# Altium project Subboard.PrjPCB (part 2 of 2)

## Sheet uc1B.SchDoc: Microcontroller 1 (Part B)
size A4; Author: Marcel Hellwig; Organization: Hamburg Bit-Bots; Address1: Vogt-Kölln-Str. 30; Address2: 22527 Hamburg; Address3: Germany; Address4: www.bit-bots.de; DocumentNumber: 4; Revision: A; SheetNumber: 4; SheetTotal: 16; EMail: info@bit-bots.de
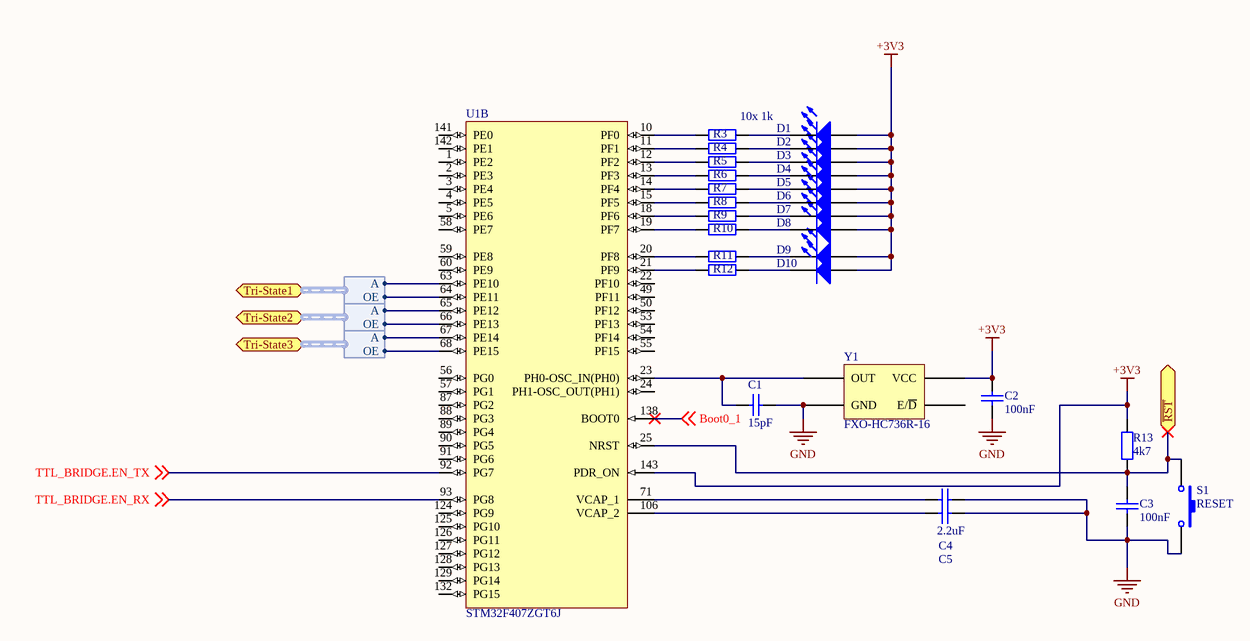
[diagram p9: uc1B.SchDoc]

### Parts
C1  15pF  [C2012]
C2  100nF  [C2012]
C3  100nF  [C2012]
C4  2.2uF  [C2012]  (value not drawn)
C5  2.2uF  [C2012]
D1  Green  [MLCC2]  (value not drawn)
D2  Green  [MLCC2]  (value not drawn)
D3  Green  [MLCC2]  (value not drawn)
D4  Green  [MLCC2]  (value not drawn)
D5  Green  [MLCC2]  (value not drawn)
D6  Green  [MLCC2]  (value not drawn)
D7  Green  [MLCC2]  (value not drawn)
D8  Green  [MLCC2]  (value not drawn)
D9  Green  [MLCC2]  (value not drawn)
D10  Green  [MLCC2]  (value not drawn)
R3  1k  [R2012]  (value not drawn)
R4  1k  [R2012]  (value not drawn)
R5  1k  [R2012]  (value not drawn)
R6  1k  [R2012]  (value not drawn)
R7  1k  [R2012]  (value not drawn)
R8  1k  [R2012]  (value not drawn)
R9  1k  [R2012]  (value not drawn)
R10  1k  [R2012]  (value not drawn)
R11  1k  [R2012]  (value not drawn)
R12  1k  [R2012]  (value not drawn)
R13  4k7  [R2012]
S1  RESET  [SWITCH]
U1  STM32F407ZGT6J  [STM-LQFP144_M]  (part B of 3)
Y1  FXO-HC736R-16  [FXO-HC73]

### Ports
Tri-State1 (harness Tri-State), Tri-State2 (harness Tri-State), Tri-State3 (harness Tri-State), ~{RST}

### Harnesses
Tri-State: A, OE

### Nets
+3V3: C2.1 D1.1(A) D2.1(A) D3.1(A) D4.1(A) D5.1(A) D6.1(A) D7.1(A) D8.1(A) D9.1(A) D10.1(A) R13.1 U1.143(PDR_ON) Y1.4(VCC)
GND: C1.1 C2.2 C3.1 C4.2 C5.2 S1.2 Y1.2(GND)
~{RST}: C3.2 R13.2 S1.1 U1.25(NRST) ; port ~{RST}
Boot0_1: U1.138(BOOT0) ; off-sheet Boot0_1
TTL_BRIDGE.EN_RX: U1.93(PG8) ; off-sheet TTL_BRIDGE.EN_RX
TTL_BRIDGE.EN_TX: U1.92(PG7) ; off-sheet TTL_BRIDGE.EN_TX
NetC1_2: C1.2 U1.23(PH0-OSC_IN(PH0)) Y1.3(OUT)
NetC4_1: C4.1 U1.71(VCAP_1)
NetC5_1: C5.1 U1.106(VCAP_2)
NetD1_2: D1.2(K) R3.2
NetD2_2: D2.2(K) R4.2
NetD3_2: D3.2(K) R5.2
NetD4_2: D4.2(K) R6.2
NetD5_2: D5.2(K) R7.2
NetD6_2: D6.2(K) R8.2
NetD7_2: D7.2(K) R9.2
NetD8_2: D8.2(K) R10.2
NetD9_2: D9.2(K) R11.2
NetD10_2: D10.2(K) R12.2
NetR3_1: R3.1 U1.10(PF0)
NetR4_1: R4.1 U1.11(PF1)
NetR5_1: R5.1 U1.12(PF2)
NetR6_1: R6.1 U1.13(PF3)
NetR7_1: R7.1 U1.14(PF4)
NetR8_1: R8.1 U1.15(PF5)
NetR9_1: R9.1 U1.18(PF6)
NetR10_1: R10.1 U1.19(PF7)
NetR11_1: R11.1 U1.20(PF8)
NetR12_1: R12.1 U1.21(PF9)
NetU1_63: U1.63(PE10) ; port Tri-State1.A
NetU1_64: U1.64(PE11) ; port Tri-State1.OE
NetU1_65: U1.65(PE12) ; port Tri-State2.A
NetU1_66: U1.66(PE13) ; port Tri-State2.OE
NetU1_67: U1.67(PE14) ; port Tri-State3.A
NetU1_68: U1.68(PE15) ; port Tri-State3.OE

Not connected (* = marked no-connect by the designer): U1 1(PE2) 2(PE3) 3(PE4) 4(PE5) 5(PE6) 22(PF10) 24(PH1-OSC_OUT(PH1)) 49(PF11) 50(PF12) 53(PF13) 54(PF14) 55(PF15) 56(PG0) 57(PG1) 58(PE7) 59(PE8) 60(PE9) 87(PG2) 88(PG3) 89(PG4) 90(PG5) 91(PG6) 124(PG9) 125(PG10) 126(PG11) 127(PG12) 128(PG13) 129(PG14) 132(PG15) 141(PE0) 142(PE1); Y1 1(E/~{D})

### Notes on the sheet
- (near R3) 10x 1k
- Project:
- Author:
- Title:
- Rev:
- Date:
- Time:
- Sheet
- of

### Library data of the parts
C1 = Cap: Capacitor; Manufacturer: MULTICOMP; Manufacturer Part Number: MC0805N150J500CT; Produktpalette: Baureihe MC; Kapazität: 15; Kapazitätstoleranz: ±5%; Dielektrikum: C0G / NP0; Nennspannung: 50; Keramikkondensatorgehäuse: 0805 [Metrisch 2012]; Betriebstemperatur, min.: -55; Betriebstemperatur, max.: 125; Verpackung: Gurtabschnitt; SVHC: No SVHC (17-Dec-2014); Betriebstemperatur: -55°C bis +125; Kondensatoranschlüsse: SMD<!--FANDB--><div class="features-and-benefits-container"></div>; Published: 8-Jun-2000; LatestRevisionDate: 17-Jul-2002; LatestRevisionNote: Re-released for DXP Platform.; PackageReference: RAD-0.3; Publisher: Altium Limited; PackageDescription: Radial Cap, Thru-Hole; 2 Leads; 0.3 in Pin Spacing; Value: 15pF; Supplier 1: Farnell; Supplier Part Number 1: 1759193; RoHS: YES; Stock 1: 38433; Pricing 1: 10=0,021, 100=0,017, 500=0,014, 1000=0,012, 2000=0,009 (EUR); MSL: -; Bauform: 0805 [Metrisch 2012]; Kapazitätstoleranz ±: ±5%; ComponentLink1URL: http://www.farnell.com/datasheets/1870456.pdf; ComponentLink1Description: http://www.farnell.com/datasheets/1870456.pdf
C2 = Cap: Capacitor; Published: 8-Jun-2000; LatestRevisionDate: 17-Jul-2002; LatestRevisionNote: Re-released for DXP Platform.; PackageReference: RAD-0.3; Publisher: Altium Limited; PackageDescription: Radial Cap, Thru-Hole; 2 Leads; 0.3 in Pin Spacing; Value: 100nF; Supplier 1: Farnell; Supplier Part Number 1: 1759265
C3 = Cap: Capacitor; Manufacturer: MULTICOMP; Manufacturer Part Number: MC0805B104K500CT; Produktpalette: Baureihe MC; Kapazität: 0.1; Kapazitätstoleranz: ±10%; Dielektrikum: X7; Nennspannung: 50; Keramikkondensatorgehäuse: 0805 [Metrisch 2012]; Betriebstemperatur, min.: -55; Betriebstemperatur, max.: 125; Verpackung: Gurtabschnitt; SVHC: No SVHC (17-Dec-2014); Betriebstemperatur: -55°C bis +125; Kondensatoranschlüsse: SMD<!--FANDB--><div class="features-and-benefits-container"></div>; Published: 8-Jun-2000; LatestRevisionDate: 17-Jul-2002; LatestRevisionNote: Re-released for DXP Platform.; PackageReference: RAD-0.3; Publisher: Altium Limited; PackageDescription: Radial Cap, Thru-Hole; 2 Leads; 0.3 in Pin Spacing; Value: 100nF; Supplier 1: Farnell; Supplier Part Number 1: 1759265; RoHS: YES; Stock 1: 692587; Pricing 1: 10=0,013, 100=0,011, 500=0,009, 1000=0,008, 2000=0,006 (EUR); MSL: -; Bauform: 0805 [Metrisch 2012]; Kapazitätstoleranz ±: ±10%; ComponentLink1URL: http://www.farnell.com/datasheets/1870456.pdf; ComponentLink1Description: http://www.farnell.com/datasheets/1870456.pdf
C4 C5 = Cap: Capacitor; Manufacturer: MULTICOMP; Manufacturer Part Number: MC0805B225K250CT; Produktpalette: Baureihe MC; Kapazität: 2.2; Kapazitätstoleranz: ±10%; Dielektrikum: X7; Nennspannung: 25; Keramikkondensatorgehäuse: 0805 [Metrisch 2012]; Betriebstemperatur, min.: -55; Betriebstemperatur, max.: 125; Verpackung: Gurtabschnitt; Kondensatoranschlüsse: SMD<!--FANDB--><div class="features-and-benefits-container"></div>; Published: 8-Jun-2000; LatestRevisionDate: 17-Jul-2002; LatestRevisionNote: Re-released for DXP Platform.; PackageReference: RAD-0.3; Publisher: Altium Limited; PackageDescription: Radial Cap, Thru-Hole; 2 Leads; 0.3 in Pin Spacing; Value: 2.2uF; Supplier 1: Farnell; Supplier Part Number 1: 2320829; RoHS: YES; Stock 1: 13870; Pricing 1: 10=0,101, 100=0,084, 500=0,071, 1000=0,058, 1500=0,046 (EUR); MSL: MSL 1 - unbegrenzt; Bauform: 0805 [Metrisch 2012]; Kapazitätstoleranz ±: ±10%; ComponentLink1URL: http://www.farnell.com/datasheets/1870456.pdf; ComponentLink1Description: http://www.farnell.com/datasheets/1870456.pdf
D1-D10 = LED0: Typical INFRARED GaAs LED; Manufacturer: VISHAY; Manufacturer Part Number: VLMC3100-GS08; Leuchtengröße: 2.4; LED-Farbe: Grün; Lichtstärke: 1.6; Abstrahlwinkel: 120°; Durchlassstrom If: 2; Durchlassspannung: 1.9; LED-Montage: Oberflächenmontage; Linsenform: Rund; Wellenlänge, typ.: 575; Verpackung: Gurtabschnitt; SVHC: No SVHC (16-Jun-2014); Betriebstemperatur: -40°C bis +100; Betriebstemperatur, max.: 100; Betriebstemperatur, min.: -40; LED-Typ: Standard; LED/Lampen Größe: PLCC-2; Montage: SMD; Sperrspannung: 6; Spitzenwellenlänge: 565; Winkel halber Empfindlichkeit ±: 60; Published: 8-Jun-2000; LatestRevisionDate: 08-Jul-2005; LatestRevisionNote: Mech Layer 1 removed.; PackageReference: LED-0; Publisher: Altium Limited; PackageDescription: LED; 2 Leads; Supplier 1: Farnell; Supplier Part Number 1: 1659076; RoHS: YES; Stock 1: 12975; Pricing 1: 5=0,105, 25=0,0998, 100=0,0952, 250=0,0917, 500=0,0865, 2000=0,0771, 4000=0,0717, 20000=0,0689 (EUR); MSL: MSL 2A - 4 Wochen; Anzahl der Pins: 2; Dominante Wellenlänge: 575; Durchlassspannung Vf max.: 2.4; Durchlassstrom If, max.: 2; Lichtstärke, typ.: 1.6; ComponentLink1URL: http://www.farnell.com/datasheets/1698102.pdf; ComponentLink1Description: http://www.farnell.com/datasheets/1698102.pdf
R3-R12 = Res2: as R47 on sheet connector; Published: 8-Jun-2000; LatestRevisionDate: 17-Jul-2002; LatestRevisionNote: Re-released for DXP Platform.; PackageReference: AXIAL-0.4; Publisher: Altium Limited; PackageDescription: Axial Device, Thru-Hole; 2 Leads; 0.4 in Pin Spacing; Value: 1k; Supplier 1: Farnell; Supplier Part Number 1: 9332391; RoHS: Y-EX; Stock 1: 4370; Pricing 1: 50=0,038, 250=0,031, 1000=0,022, 5000=0,014, 15000=0,009 (EUR); ComponentLink1URL: http://www.farnell.com/datasheets/1729047.pdf; ComponentLink1Description: http://www.farnell.com/datasheets/1729047.pdf; ComponentLink2URL: http://www.farnell.com/cad/1561156.zip; ComponentLink2Description: http://www.farnell.com/cad/1561156.zip
R13 = Res2: Resistor; Manufacturer: MULTICOMP; Manufacturer Part Number: MC01W080514K7; Produktpalette: Baureihe MC; Widerstand: 4.7; Nennleistung: 100; Widerstandstoleranz: ±1%; Bauform: 0805 [Metrisch 2012]; Widerstandselement: Dickschicht; Temperaturkoeffizient: ±100; Nennspannung: 150; Verpackung: Gurtabschnitt; SVHC: No SVHC (17-Dec-2014); Anzahl der Pins: 2; Außenbreite: 1.25; Außentiefe: 0.55; Bandbreite: 8; Baureihe: MC; Betriebstemperatur: -55°C bis +155; Betriebstemperatur, max.: 155; Betriebstemperatur, min.: -55; Menge pro Rolle: 5000; Toleranz (+): 1%; Widerstandsmontage: Oberflächenmontage<!--FANDB--><div class="features-and-benefits-container"></div>; Published: 8-Jun-2000; LatestRevisionDate: 17-Jul-2002; LatestRevisionNote: Re-released for DXP Platform.; PackageReference: AXIAL-0.4; Publisher: Altium Limited; PackageDescription: Axial Device, Thru-Hole; 2 Leads; 0.4 in Pin Spacing; Value: 4k7; Supplier 1: Farnell; Supplier Part Number 1: 9333266; RoHS: Y-EX; Stock 1: 190984; Pricing 1: 50=0,038, 250=0,031, 1000=0,022, 5000=0,014, 15000=0,009 (EUR); MSL: -; Außenlänge/-höhe: 2; Nennspannung, V DC: 150; Temperaturkoeffizient, +: 100; Temperaturkoeffizient, -: 100; Toleranz (-): 1%; ComponentLink1URL: http://www.farnell.com/datasheets/1729047.pdf; ComponentLink1Description: http://www.farnell.com/datasheets/1729047.pdf; ComponentLink2URL: http://www.farnell.com/cad/1561170.zip; ComponentLink2Description: http://www.farnell.com/cad/1561170.zip
S1 = SW-PB: Switch; Published: 24-Mar-1999; LatestRevisionDate: 17-Jul-2002; LatestRevisionNote: Re-released for DXP Platform.; PackageReference: SPST-2; Publisher: Altium Limited; PackageDescription: Switch; 2 Leads; Supplier 1: Farnell; Supplier Part Number 1: 2396053
U1 = CMP-0243-00063-2: ARM Cortex-M4 32-bit MCU+FPU, 210 DMIPS, 1024 kB Flash, 192 kB Internal RAM, 114 I/Os, 144-pin LQFP, -40 to 85 degC, Tray; Manufacturer: STMicroelectronics; I/Os (High Current): 114; D/A Converter: 2x12-bit; Internal RAM Size (kB): 192; Operating Frequency(F) (Processor speed) (MHz): 168; Supply Voltage(Vcc) max (V): 3.6; Supply Voltage(Vcc) min (V): 1.8; FLASH Size (Prog) (kB): 1024; ComponentLink3Description: Package Specification; PackageVersion: Rev. 4, 06/2013; PartNumber: STM32F407ZGT6J; ComponentLink3URL: http://www.st.com/st-web-ui/static/active/en/resource/technical/document/datasheet/DM00037051.pdf; PackageReference: LQFP144; ComponentLink2URL: http://www.st.com/st-web-ui/static/active/en/resource/technical/document/datasheet/DM00037051.pdf; ComponentLink2Description: Datasheet; ComponentLink1Description: Manufacturer URL; Mounting Technology: Surface Mount; Core: ARM Cortex-M4; PackageDescription: 144-Pin Low Profile Quad Flat Package, 20 x 20 mm Body, 0.5 mm Pitch; Packing: Tray; ComponentLink1URL: http://www.st.com/web/en/home.html; DatasheetVersion: Rev. 4; PartId: 1; Supplier 1: Farnell; Supplier Part Number 1: 2333299
Y1 = Oszillator: Oscillator with Enable Input; Manufacturer: FOX ELECTRONICS; Produktpalette: Baureihe FXO-HC53; Nennfrequenz: 16; Frequenzstabilität + / -: 25; Versorgungsspannung, nom.: 3.3; Oszillatorgehäuse: SMD, 7mm x 5; Kompatibler Oszillatorausgang: HCMOS; Betriebstemperatur, min.: -40; Betriebstemperatur, max.: 85; SVHC: No SVHC (17-Dec-2014; Supplier 1: Farnell; Supplier Part Number 1: 1640997; Manufacturer Part Number: FXO-HC736R-16; RoHS: YES; Stock 1: 98; Pricing 1: 1=1,74, 25=1,71, 50=1,68, 100=1,65, 200=1,62, 700=1,59, 2000=1,56, 4000=1,52 (EUR); ComponentLink1URL: http://www.farnell.com/datasheets/75444.pdf; ComponentLink1Description: http://www.farnell.com/datasheets/75444.pdf

## Sheet uc1C.SchDoc: Microcontroller 1 (Part C)
size A4; Author: Marcel Hellwig; Organization: Hamburg Bit-Bots; Address1: Vogt-Kölln-Str. 30; Address2: 22527 Hamburg; Address3: Germany; Address4: www.bit-bots.de; DocumentNumber: 5; Revision: A; SheetNumber: 5; SheetTotal: 16; EMail: info@bit-bots.de
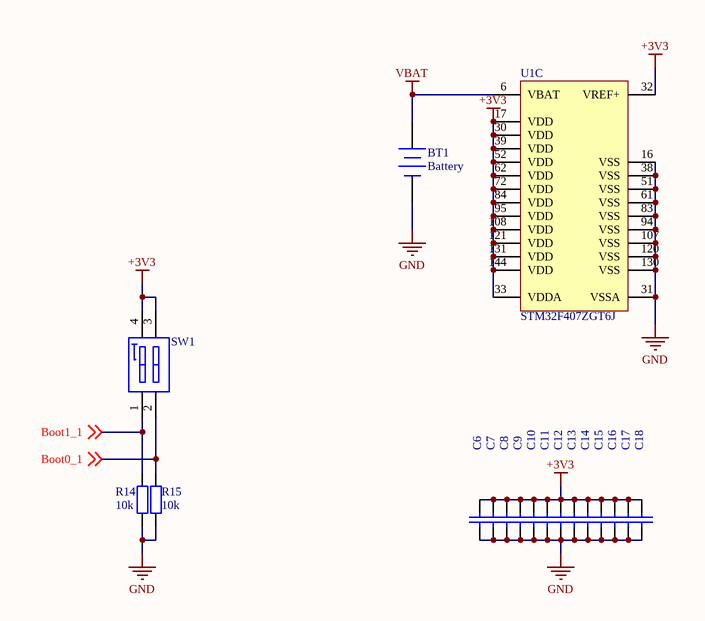
[diagram p10: uc1C.SchDoc]

### Parts
BT1  Battery  [2032 SMD Holder]
C6  100nF  [C2012]  (value not drawn)
C7  100nF  [C2012]  (value not drawn)
C8  100nF  [C2012]  (value not drawn)
C9  100nF  [C2012]  (value not drawn)
C10  100nF  [C2012]  (value not drawn)
C11  100nF  [C2012]  (value not drawn)
C12  100nF  [C2012]  (value not drawn)
C13  100nF  [C2012]  (value not drawn)
C14  100nF  [C2012]  (value not drawn)
C15  100nF  [C2012]  (value not drawn)
C16  100nF  [C2012]  (value not drawn)
C17  100nF  [C2012]  (value not drawn)
C18  100nF  [C2012]  (value not drawn)
R14  10k  [R2012]
R15  10k  [R2012]
SW1  418121270802  [418121270802]  (value not drawn)
U1  STM32F407ZGT6J  [STM-LQFP144_M]  (part C of 3)

### Nets
+3V3: C6.2 C7.2 C8.2 C9.2 C10.2 C11.2 C12.2 C13.2 C14.2 C15.2 C16.2 C17.2 C18.2 SW1.3 SW1.4 U1.17(VDD) U1.30(VDD) U1.32(VREF+) U1.33(VDDA) U1.39(VDD) U1.52(VDD) U1.62(VDD) U1.72(VDD) U1.84(VDD) U1.95(VDD) U1.108(VDD) U1.121(VDD) U1.131(VDD) U1.144(VDD)
GND: BT1.2(-) C6.1 C7.1 C8.1 C9.1 C10.1 C11.1 C12.1 C13.1 C14.1 C15.1 C16.1 C17.1 C18.1 R14.2 R15.1 U1.16(VSS) U1.31(VSSA) U1.38(VSS) U1.51(VSS) U1.61(VSS) U1.83(VSS) U1.94(VSS) U1.107(VSS) U1.120(VSS) U1.130(VSS)
VBAT: BT1.1(+) U1.6(VBAT)
Boot0_1: R15.2 SW1.2 ; off-sheet Boot0_1
Boot1_1: R14.1 SW1.1 ; off-sheet Boot1_1

### Notes on the sheet
- Project:
- Author:
- Title:
- Rev:
- Date:
- Time:
- Sheet
- of

### Library data of the parts
BT1 = Battery: Multicell Battery; Manufacturer: MULTICOMP; Manufacturer Part Number: CH28-2032LF; Published: 24-Mar-1999; LatestRevisionDate: 17-Jul-2002; LatestRevisionNote: Re-released for DXP Platform.; PackageReference: BAT-2; Publisher: Altium Limited; PackageDescription: Battery; 2 Leads; Supplier 1: Farnell; Supplier Part Number 1: 2064725; RoHS: YES; Stock 1: 10755; Pricing 1: 5=0,458, 25=0,415, 100=0,373, 250=0,303 (EUR); ComponentLink1URL: http://www.farnell.com/datasheets/1505865.pdf; ComponentLink1Description: http://www.farnell.com/datasheets/1505865.pdf
C6-C18 = Cap: as C3 on sheet uc1B; Published: 8-Jun-2000; LatestRevisionDate: 17-Jul-2002; LatestRevisionNote: Re-released for DXP Platform.; PackageReference: RAD-0.3; Publisher: Altium Limited; PackageDescription: Radial Cap, Thru-Hole; 2 Leads; 0.3 in Pin Spacing; Value: 100nF; Supplier 1: Farnell; Supplier Part Number 1: 1759265; RoHS: YES; Stock 1: 692587; Pricing 1: 10=0,013, 100=0,011, 500=0,009, 1000=0,008, 2000=0,006 (EUR); MSL: -; Bauform: 0805 [Metrisch 2012]; Kapazitätstoleranz ±: ±10%; ComponentLink1URL: http://www.farnell.com/datasheets/1870456.pdf; ComponentLink1Description: http://www.farnell.com/datasheets/1870456.pdf
R14 R15 = Res2: as R47 on sheet connector; Published: 8-Jun-2000; LatestRevisionDate: 17-Jul-2002; LatestRevisionNote: Re-released for DXP Platform.; PackageReference: AXIAL-0.4; Publisher: Altium Limited; PackageDescription: Axial Device, Thru-Hole; 2 Leads; 0.4 in Pin Spacing; Value: 10k; Supplier 1: Farnell; Supplier Part Number 1: 9332391; RoHS: Y-EX; Stock 1: 4370; Pricing 1: 50=0,038, 250=0,031, 1000=0,022, 5000=0,014, 15000=0,009 (EUR); ComponentLink1URL: http://www.farnell.com/datasheets/1729047.pdf; ComponentLink1Description: http://www.farnell.com/datasheets/1729047.pdf; ComponentLink2URL: http://www.farnell.com/cad/1561156.zip; ComponentLink2Description: http://www.farnell.com/cad/1561156.zip
SW1 = CMP-1438-00002-1: WS-DISV 2.54 mm small compact SMD Dip Switch with raised actuator; Manufacturer: Wuerth Elektronik; Manufacturer Part Number: A6S2104H; NoPins: 04; ComponentLink2URL: http://katalog.we-online.de/em/datasheet/4181212708xx.pdf; ComponentLink2Description: Datasheet; PackageReference: 418121270802; ComponentLink1Description: Manufacturer URL; PartNumber: 418121270802; ComponentLink1URL: http://www.we-online.com; Supplier 1: Farnell; Supplier Part Number 1: 1960894; RoHS: YES; Pricing 1: 1=1,79, 10=1,49, 25=1,23, 50=1,01, 100=0,921, 200=0,821, 500=0,651, 2000=0,625 (EUR); ComponentLink3URL: http://www.farnell.com/datasheets/1763372.pdf; ComponentLink3Description: http://www.farnell.com/datasheets/1763372.pdf
U1 = CMP-0243-00063-2: as U1 on sheet uc1B; ComponentLink3Description: Package Specification; PackageVersion: Rev. 4, 06/2013; PartNumber: STM32F407ZGT6J; ComponentLink3URL: http://www.st.com/st-web-ui/static/active/en/resource/technical/document/datasheet/DM00037051.pdf; PackageReference: LQFP144; ComponentLink2URL: http://www.st.com/st-web-ui/static/active/en/resource/technical/document/datasheet/DM00037051.pdf; ComponentLink2Description: Datasheet; ComponentLink1Description: Manufacturer URL; Mounting Technology: Surface Mount; Core: ARM Cortex-M4; PackageDescription: 144-Pin Low Profile Quad Flat Package, 20 x 20 mm Body, 0.5 mm Pitch; Packing: Tray; ComponentLink1URL: http://www.st.com/web/en/home.html; DatasheetVersion: Rev. 4; PartId: 1; Supplier 1: Farnell; Supplier Part Number 1: 2333299

## Sheet uc2.SchDoc: Microcontroller 2
size A4; Author: Marcel Hellwig; Organization: Hamburg Bit-Bots; Address1: Vogt-Kölln-Str. 30; Address2: 22527 Hamburg; Address3: Germany; Address4: www.bit-bots.de; DocumentNumber: 6; Revision: A; SheetNumber: 6; SheetTotal: 16; EMail: info@bit-bots.de
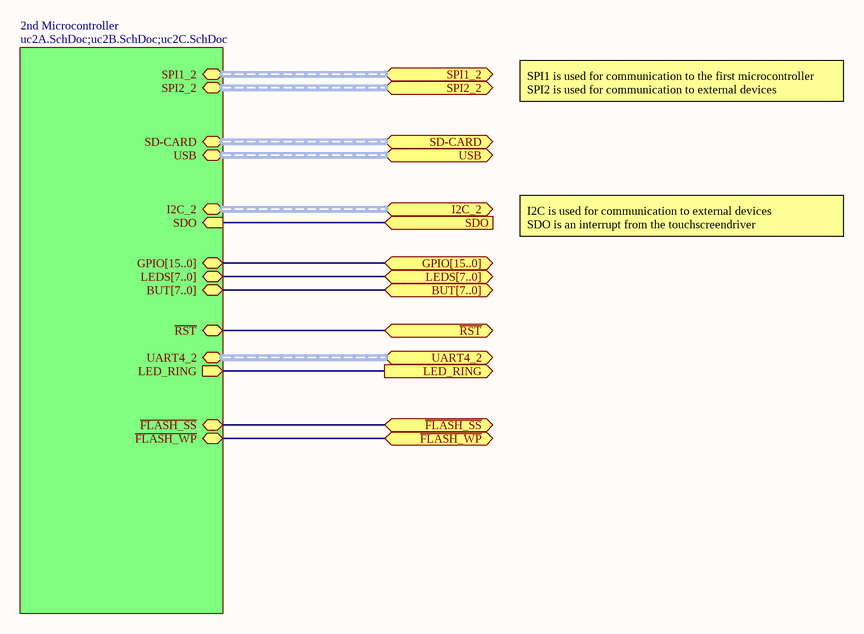
[diagram p11: uc2.SchDoc]

### Sub-sheets
2nd Microcontroller = uc2A.SchDoc;uc2B.SchDoc;uc2C.SchDoc: SPI1_2 (harness SPI), SD-CARD (harness SD-Card), USB (harness USB), I2C_2 (harness I²C), ~{RST}, SDO (in), GPIO[15..0] (bidir), LEDS[7..0] (bidir), BUT[7..0] (bidir), SPI2_2 (harness SPI), UART4_2 (harness UART), LED_RING (out), ~{FLASH_SS} (bidir), ~{FLASH_WP} (bidir)

### Ports
BUT[7..0] (bidir), GPIO[15..0] (bidir), I2C_2 (harness I²C), LED_RING (out), LEDS[7..0] (bidir), SD-CARD (harness SD-Card), SDO (in), SPI1_2 (harness SPI), SPI2_2 (harness SPI), UART4_2 (harness UART), USB (harness USB), ~{FLASH_SS} (bidir), ~{FLASH_WP} (bidir), ~{RST}

### Nets
~{FLASH_SS}: port ~{FLASH_SS}, sheet 2nd Microcontroller/~{FLASH_SS}
~{FLASH_WP}: port ~{FLASH_WP}, sheet 2nd Microcontroller/~{FLASH_WP}
~{RST}: port ~{RST}, sheet 2nd Microcontroller/~{RST}
LED_RING: port LED_RING, sheet 2nd Microcontroller/LED_RING
SDO: port SDO, sheet 2nd Microcontroller/SDO

### Buses and harness runs
bus port BUT[7..0] = sheet 2nd Microcontroller/BUT[7..0]
bus port GPIO[15..0] = sheet 2nd Microcontroller/GPIO[15..0]
bus port LEDS[7..0] = sheet 2nd Microcontroller/LEDS[7..0]
harness port I2C_2 = sheet 2nd Microcontroller/I2C_2
harness port SD-CARD = sheet 2nd Microcontroller/SD-CARD
harness port SPI1_2 = sheet 2nd Microcontroller/SPI1_2
harness port SPI2_2 = sheet 2nd Microcontroller/SPI2_2
harness port UART4_2 = sheet 2nd Microcontroller/UART4_2
harness port USB = sheet 2nd Microcontroller/USB

### Notes on the sheet
- SPI1 is used for communication to the first microcontroller
  SPI2 is used for communication to external devices
- I2C is used for communication to external devices
  SDO is an interrupt from the touchscreendriver
- Project:
- Author:
- Title:
- Rev:
- Date:
- Time:
- Sheet
- of

## Sheet uc2A.SchDoc: Microcontroller 2 (Part A)
size A4; Author: Marcel Hellwig; Organization: Hamburg Bit-Bots; Address1: Vogt-Kölln-Str. 30; Address2: 22527 Hamburg; Address3: Germany; Address4: www.bit-bots.de; DocumentNumber: 7; Revision: A; SheetNumber: 7; SheetTotal: 16; EMail: info@bit-bots.de
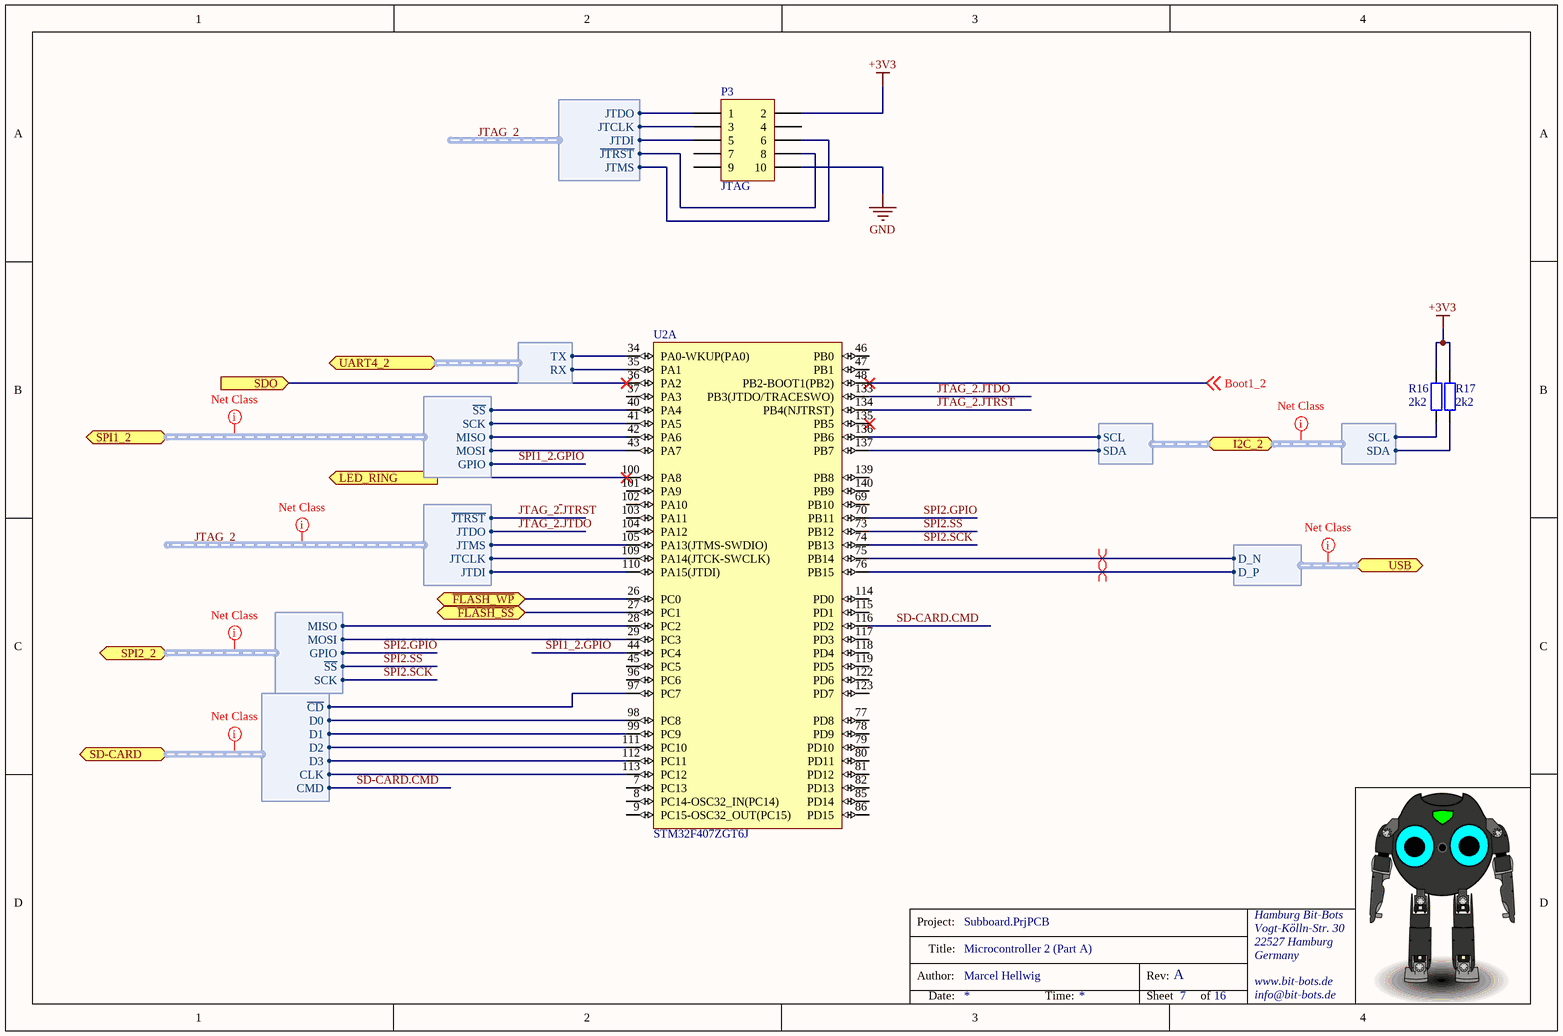
[diagram p12: uc2A.SchDoc]

### Parts
P3  JTAG  [HDR2X5]  (no BOM)
R16  2k2  [R2012]
R17  2k2  [R2012]
U2  STM32F407ZGT6J  [STM-LQFP144_M]  (part A of 3)

### Ports
I2C_2 (harness I²C), LED_RING (out), SD-CARD (harness SD-Card), SDO (in), SPI1_2 (harness SPI), SPI2_2 (harness SPI), UART4_2 (harness UART), USB (harness USB), ~{FLASH_SS} (bidir), ~{FLASH_WP} (bidir)

### Harnesses
SPI: ~{SS}, SCK, MISO, MOSI, GPIO
USB: D_N, D_P
JTAG: ~{JTRST}, JTCLK, JTDI, JTDO, JTMS
I²C: SCL, SDA
UART: TX, RX
SD-Card: D0, D1, D2, D3, CLK, CMD, ~{CD}
SPI: ~{SS}, MISO, MOSI, SCK, GPIO

### Nets
+3V3: P3.2 R16.1 R17.2
GND: P3.10
~{FLASH_SS}: U2.27(PC1) ; port ~{FLASH_SS}
~{FLASH_WP}: U2.26(PC0) ; port ~{FLASH_WP}
Boot1_2: U2.48(PB2-BOOT1(PB2)) ; off-sheet Boot1_2
JTAG_2~{.}JTRST: P3.8 U2.134(PB4(NJTRST)) ; harness JTAG.~{JTRST}
JTAG_2.JTCLK: P3.3 U2.109(PA14(JTCK-SWCLK)) ; harness JTAG.JTCLK
JTAG_2.JTDI: P3.5 U2.110(PA15(JTDI)) ; harness JTAG.JTDI
JTAG_2.JTDO: P3.1 U2.133(PB3(JTDO/TRACESWO)) ; harness JTAG.JTDO
JTAG_2.JTMS: P3.6 U2.105(PA13(JTMS-SWDIO)) ; harness JTAG.JTMS
LED_RING: U2.100(PA8) ; port LED_RING
SD-CARD.CMD: U2.116(PD2) ; port SD-CARD.CMD
SDO: U2.36(PA2) ; port SDO
SPI1_2.GPIO: U2.44(PC4) ; port SPI1_2.GPIO  [project net SPI1_1.GPIO]
SPI2~{.}SS: U2.73(PB12) ; port SPI2_2.~{SS}
SPI2.GPIO: U2.70(PB11) ; port SPI2_2.GPIO
SPI2.SCK: U2.74(PB13) ; port SPI2_2.SCK
NetCN1_2: U2.75(PB14) ; port USB.D_N
NetCN1_3: U2.76(PB15) ; port USB.D_P
NetCN2_1: U2.111(PC10) ; port SD-CARD.D2
NetCN2_2: U2.112(PC11) ; port SD-CARD.D3
NetCN2_5: U2.113(PC12) ; port SD-CARD.CLK
NetCN2_7: U2.98(PC8) ; port SD-CARD.D0
NetCN2_8: U2.99(PC9) ; port SD-CARD.D1
NetCN2_A: U2.97(PC7) ; port SD-CARD.~{CD}
NetP1_A22: U2.35(PA1) ; port UART4_2.RX
NetP1_A23: U2.34(PA0-WKUP(PA0)) ; port UART4_2.TX
NetP1_A25: R16.2 U2.136(PB6) ; port I2C_2.SCL
NetP1_A26: R17.1 U2.137(PB7) ; port I2C_2.SDA
NetP1_B38: U2.29(PC3) ; port SPI2_2.MOSI
NetP1_B39: U2.28(PC2) ; port SPI2_2.MISO
NetU1_40: U2.40(PA4) ; port SPI1_2.~{SS}
NetU1_41: U2.41(PA5) ; port SPI1_2.SCK
NetU1_42: U2.42(PA6) ; port SPI1_2.MISO
NetU1_43: U2.43(PA7) ; port SPI1_2.MOSI

Not connected (* = marked no-connect by the designer): P3 4 7 9; U2 7(PC13) 8(PC14-OSC32_IN(PC14)) 9(PC15-OSC32_OUT(PC15)) 37(PA3) 45(PC5) 46(PB0) 47(PB1) 69(PB10) 77(PD8) 78(PD9) 79(PD10) 80(PD11) 81(PD12) 82(PD13) 85(PD14) 86(PD15) 96(PC6) 101(PA9) 102(PA10) 103(PA11) 104(PA12) 114(PD0) 115(PD1) 117(PD3) 118(PD4) 119(PD5) 122(PD6) 123(PD7) 135(PB5)* 139(PB8) 140(PB9)

### Layout directives
net class SPI; net class SPI1: (no net found under the mark)
differential pair: NetCN1_2, NetCN1_3
net class USB: (no net found under the mark)
net class JTAG: (no net found under the mark)
net class I2C: (no net found under the mark)
net class SDCARD: (no net found under the mark)
net class SPI; net class SPI2: (no net found under the mark)

### Notes on the sheet
- Project:
- Author:
- Title:
- Rev:
- Date:
- Time:
- Sheet
- of

### Library data of the parts
P3 = Header 5X2: Header, 5-Pin, Dual row; LatestRevisionDate: 17-Jul-2002; LatestRevisionNote: Re-released for DXP Platform.; Publisher: Altium Limited
R16 R17 = Res2: Resistor; Manufacturer: MULTICOMP; Manufacturer Part Number: MCMR08X2201FTL; Produktpalette: Baureihe MCMR; Widerstand: 2.2; Nennleistung: 125; Widerstandstoleranz: ±1%; Bauform: 0805 [Metrisch 2012]; Widerstandselement: Keramik; Temperaturkoeffizient: ±100; Nennspannung: 150; Verpackung: Gurtabschnitt; SVHC: No SVHC (17-Dec-2014); Widerstandsmontage: Oberflächenmontage<!--FANDB--><div class="features-and-benefits-container"></div>; Published: 8-Jun-2000; LatestRevisionDate: 17-Jul-2002; LatestRevisionNote: Re-released for DXP Platform.; PackageReference: AXIAL-0.4; Publisher: Altium Limited; PackageDescription: Axial Device, Thru-Hole; 2 Leads; 0.4 in Pin Spacing; Value: 2k2; Supplier 1: Farnell; Supplier Part Number 1: 2073690; RoHS: YES; Stock 1: 38600; Pricing 1: 100=0,014, 500=0,011, 1000=0,01 (EUR); MSL: -; ComponentLink1URL: http://www.farnell.com/datasheets/1716708.pdf; ComponentLink1Description: http://www.farnell.com/datasheets/1716708.pdf
U2 = CMP-0243-00063-2: as U1 on sheet uc1B; ComponentLink3Description: Package Specification; PackageVersion: Rev. 4, 06/2013; PartNumber: STM32F407ZGT6J; ComponentLink3URL: http://www.st.com/st-web-ui/static/active/en/resource/technical/document/datasheet/DM00037051.pdf; PackageReference: LQFP144; ComponentLink2URL: http://www.st.com/st-web-ui/static/active/en/resource/technical/document/datasheet/DM00037051.pdf; ComponentLink2Description: Datasheet; ComponentLink1Description: Manufacturer URL; Mounting Technology: Surface Mount; Core: ARM Cortex-M4; PackageDescription: 144-Pin Low Profile Quad Flat Package, 20 x 20 mm Body, 0.5 mm Pitch; Packing: Tray; ComponentLink1URL: http://www.st.com/web/en/home.html; DatasheetVersion: Rev. 4; PartId: 1; Supplier 1: Farnell; Supplier Part Number 1: 2333299

## Sheet uc2B.SchDoc: Microcontroller 2 (Part B)
size A4; Author: Marcel Hellwig; Organization: Hamburg Bit-Bots; Address1: Vogt-Kölln-Str. 30; Address2: 22527 Hamburg; Address3: Germany; Address4: www.bit-bots.de; DocumentNumber: 8; Revision: A; SheetNumber: 8; SheetTotal: 16; EMail: info@bit-bots.de
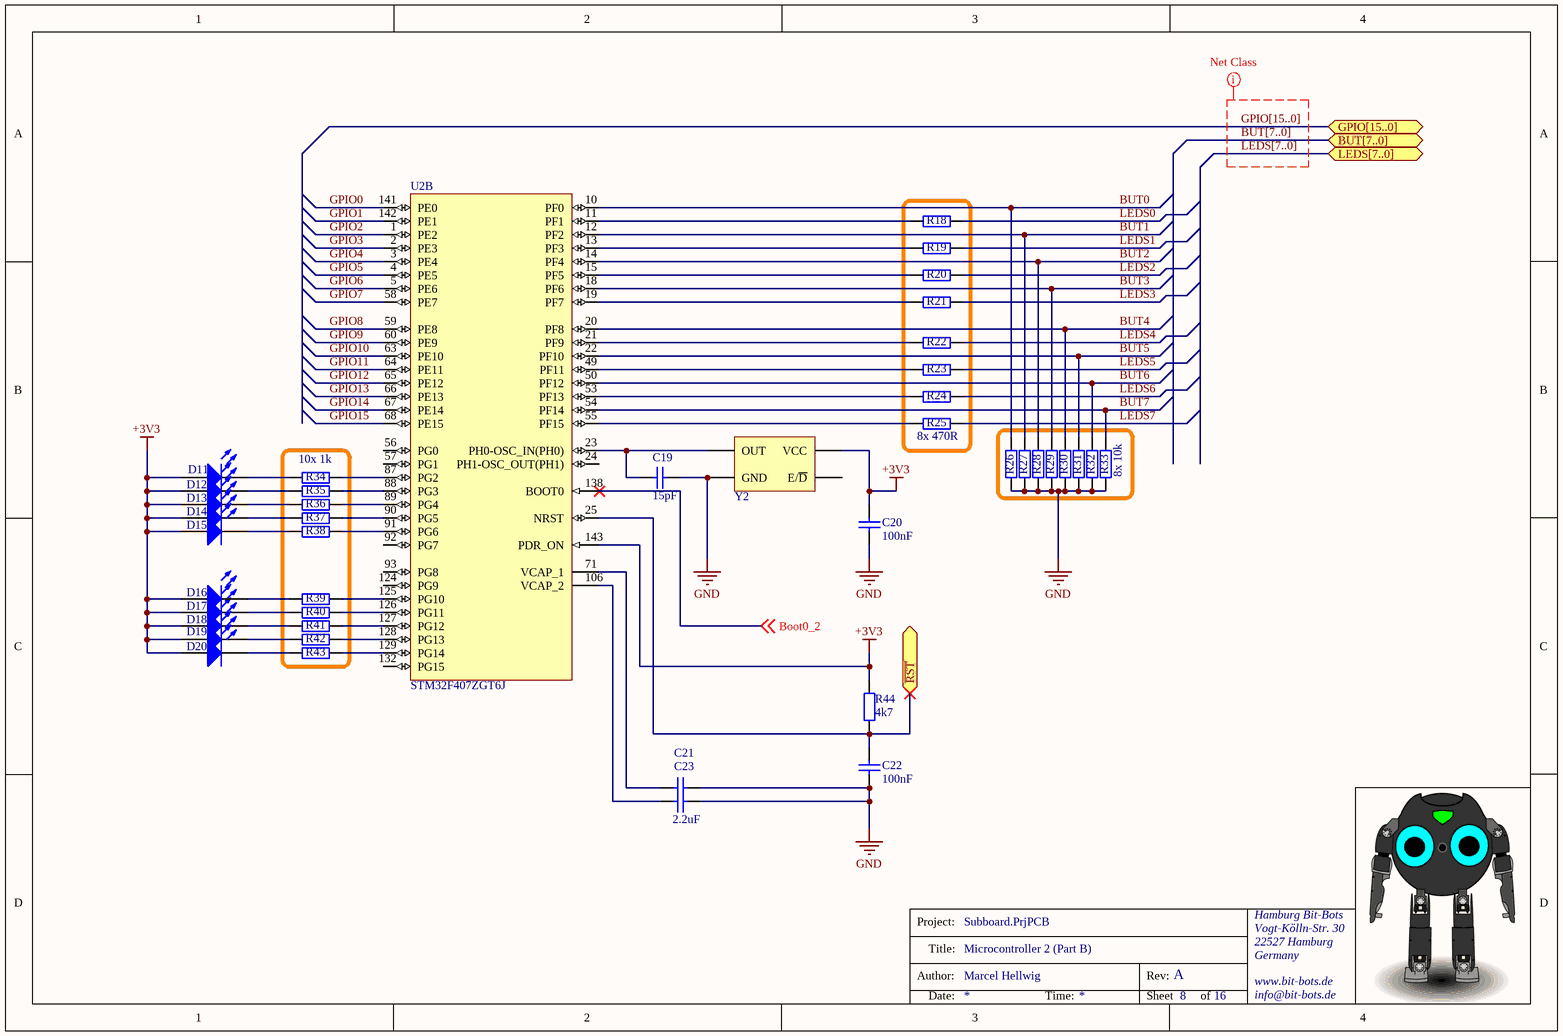
[diagram p13: uc2B.SchDoc]

### Parts
C19  15pF  [C2012]
C20  100nF  [C2012]
C21  2.2uF  [C2012]  (value not drawn)
C22  100nF  [C2012]
C23  2.2uF  [C2012]
D11  Green  [MLCC2]  (value not drawn)
D12  Green  [MLCC2]  (value not drawn)
D13  Green  [MLCC2]  (value not drawn)
D14  Green  [MLCC2]  (value not drawn)
D15  Green  [MLCC2]  (value not drawn)
D16  Green  [MLCC2]  (value not drawn)
D17  Green  [MLCC2]  (value not drawn)
D18  Green  [MLCC2]  (value not drawn)
D19  Green  [MLCC2]  (value not drawn)
D20  Green  [MLCC2]  (value not drawn)
R18  470R  [R2012]  (value not drawn)
R19  470R  [R2012]  (value not drawn)
R20  470R  [R2012]  (value not drawn)
R21  470R  [R2012]  (value not drawn)
R22  470R  [R2012]  (value not drawn)
R23  470R  [R2012]  (value not drawn)
R24  470R  [R2012]  (value not drawn)
R25  470R  [R2012]  (value not drawn)
R26  10k  [R2012]  (value not drawn)
R27  10k  [R2012]  (value not drawn)
R28  10k  [R2012]  (value not drawn)
R29  10k  [R2012]  (value not drawn)
R30  10k  [R2012]  (value not drawn)
R31  10k  [R2012]  (value not drawn)
R32  10k  [R2012]  (value not drawn)
R33  10k  [R2012]  (value not drawn)
R34  1k  [R2012]  (value not drawn)
R35  1k  [R2012]  (value not drawn)
R36  1k  [R2012]  (value not drawn)
R37  1k  [R2012]  (value not drawn)
R38  1k  [R2012]  (value not drawn)
R39  1k  [R2012]  (value not drawn)
R40  1k  [R2012]  (value not drawn)
R41  1k  [R2012]  (value not drawn)
R42  1k  [R2012]  (value not drawn)
R43  1k  [R2012]  (value not drawn)
R44  4k7  [R2012]
U2  STM32F407ZGT6J  [STM-LQFP144_M]  (part B of 3)
Y2  FXO-HC736R-16  [FXO-HC73]  (value not drawn)

### Blocks framed on the sheet
8x 470R: R18-R25
10x 1k: R34-R43
8x 10k: R26-R33

### Ports
BUT[7..0] (bidir), GPIO[15..0] (bidir), LEDS[7..0] (bidir), ~{RST}

### Nets
+3V3: C20.1 D11.1(A) D12.1(A) D13.1(A) D14.1(A) D15.1(A) D16.1(A) D17.1(A) D18.1(A) D19.1(A) D20.1(A) R44.1 U2.143(PDR_ON) Y2.4(VCC)
GND: C19.1 C20.2 C21.2 C22.1 C23.2 R26.2 R27.2 R28.2 R29.2 R30.2 R31.2 R32.2 R33.2 Y2.2(GND)
~{RST}: C22.2 R44.2 U2.25(NRST) ; port ~{RST}
Boot0_2: U2.138(BOOT0) ; off-sheet Boot0_2
BUT0: R26.1 U2.10(PF0)
BUT1: R27.1 U2.12(PF2)
BUT2: R28.1 U2.14(PF4)
BUT3: R29.1 U2.18(PF6)
BUT4: R30.1 U2.20(PF8)
BUT5: R31.1 U2.22(PF10)
BUT6: R32.1 U2.50(PF12)
BUT7: R33.1 U2.54(PF14)
GPIO0: U2.141(PE0)
GPIO1: U2.142(PE1)
GPIO2: U2.1(PE2)
GPIO3: U2.2(PE3)
GPIO4: U2.3(PE4)
GPIO5: U2.4(PE5)
GPIO6: U2.5(PE6)
GPIO7: U2.58(PE7)
GPIO8: U2.59(PE8)
GPIO9: U2.60(PE9)
GPIO10: U2.63(PE10)
GPIO11: U2.64(PE11)
GPIO12: U2.65(PE12)
GPIO13: U2.66(PE13)
GPIO14: U2.67(PE14)
GPIO15: U2.68(PE15)
LEDS0: R18.2
LEDS1: R19.2
LEDS2: R20.2
LEDS3: R21.2
LEDS4: R22.2
LEDS5: R23.2
LEDS6: R24.2
LEDS7: R25.2
NetC19_2: C19.2 U2.23(PH0-OSC_IN(PH0)) Y2.3(OUT)
NetC21_1: C21.1 U2.71(VCAP_1)
NetC23_1: C23.1 U2.106(VCAP_2)
NetD11_2: D11.2(K) R34.2
NetD12_2: D12.2(K) R35.2
NetD13_2: D13.2(K) R36.2
NetD14_2: D14.2(K) R37.2
NetD15_2: D15.2(K) R38.2
NetD16_2: D16.2(K) R39.2
NetD17_2: D17.2(K) R40.2
NetD18_2: D18.2(K) R41.2
NetD19_2: D19.2(K) R42.2
NetD20_2: D20.2(K) R43.2
NetR18_1: R18.1 U2.11(PF1)
NetR19_1: R19.1 U2.13(PF3)
NetR20_1: R20.1 U2.15(PF5)
NetR21_1: R21.1 U2.19(PF7)
NetR22_1: R22.1 U2.21(PF9)
NetR23_1: R23.1 U2.49(PF11)
NetR24_1: R24.1 U2.53(PF13)
NetR25_1: R25.1 U2.55(PF15)
NetR34_1: R34.1 U2.87(PG2)
NetR35_1: R35.1 U2.88(PG3)
NetR36_1: R36.1 U2.89(PG4)
NetR37_1: R37.1 U2.90(PG5)
NetR38_1: R38.1 U2.91(PG6)
NetR39_1: R39.1 U2.125(PG10)
NetR40_1: R40.1 U2.126(PG11)
NetR41_1: R41.1 U2.127(PG12)
NetR42_1: R42.1 U2.128(PG13)
NetR43_1: R43.1 U2.129(PG14)

Not connected (* = marked no-connect by the designer): U2 24(PH1-OSC_OUT(PH1)) 56(PG0) 57(PG1) 92(PG7) 93(PG8) 124(PG9) 132(PG15); Y2 1(E/~{D})

### Buses and harness runs
bus BUT[7..0] = port BUT[7..0]
bus GPIO[15..0] = port GPIO[15..0]
bus LEDS[7..0] = port LEDS[7..0]

### Layout directives
net class GPIO: BUT[7..0], GPIO[15..0], LEDS[7..0]

### Notes on the sheet
- Project:
- Author:
- Title:
- Rev:
- Date:
- Time:
- Sheet
- of

### Library data of the parts
C19 = Cap: as C1 on sheet uc1B; Published: 8-Jun-2000; LatestRevisionDate: 17-Jul-2002; LatestRevisionNote: Re-released for DXP Platform.; PackageReference: RAD-0.3; Publisher: Altium Limited; PackageDescription: Radial Cap, Thru-Hole; 2 Leads; 0.3 in Pin Spacing; Value: 15pF; Supplier 1: Farnell; Supplier Part Number 1: 1759193; RoHS: YES; Stock 1: 38433; Pricing 1: 10=0,021, 100=0,017, 500=0,014, 1000=0,012, 2000=0,009 (EUR); MSL: -; Bauform: 0805 [Metrisch 2012]; Kapazitätstoleranz ±: ±5%; ComponentLink1URL: http://www.farnell.com/datasheets/1870456.pdf; ComponentLink1Description: http://www.farnell.com/datasheets/1870456.pdf
C20 = Cap: Capacitor; Published: 8-Jun-2000; LatestRevisionDate: 17-Jul-2002; LatestRevisionNote: Re-released for DXP Platform.; PackageReference: RAD-0.3; Publisher: Altium Limited; PackageDescription: Radial Cap, Thru-Hole; 2 Leads; 0.3 in Pin Spacing; Value: 100nF; Supplier 1: Farnell; Supplier Part Number 1: 1759265
C21 C23 = Cap: as C4 on sheet uc1B; Published: 8-Jun-2000; LatestRevisionDate: 17-Jul-2002; LatestRevisionNote: Re-released for DXP Platform.; PackageReference: RAD-0.3; Publisher: Altium Limited; PackageDescription: Radial Cap, Thru-Hole; 2 Leads; 0.3 in Pin Spacing; Value: 2.2uF; Supplier 1: Farnell; Supplier Part Number 1: 2320829; RoHS: YES; Stock 1: 13870; Pricing 1: 10=0,101, 100=0,084, 500=0,071, 1000=0,058, 1500=0,046 (EUR); MSL: MSL 1 - unbegrenzt; Bauform: 0805 [Metrisch 2012]; Kapazitätstoleranz ±: ±10%; ComponentLink1URL: http://www.farnell.com/datasheets/1870456.pdf; ComponentLink1Description: http://www.farnell.com/datasheets/1870456.pdf
C22 = Cap: as C3 on sheet uc1B; Published: 8-Jun-2000; LatestRevisionDate: 17-Jul-2002; LatestRevisionNote: Re-released for DXP Platform.; PackageReference: RAD-0.3; Publisher: Altium Limited; PackageDescription: Radial Cap, Thru-Hole; 2 Leads; 0.3 in Pin Spacing; Value: 100nF; Supplier 1: Farnell; Supplier Part Number 1: 1759265; RoHS: YES; Stock 1: 692587; Pricing 1: 10=0,013, 100=0,011, 500=0,009, 1000=0,008, 2000=0,006 (EUR); MSL: -; Bauform: 0805 [Metrisch 2012]; Kapazitätstoleranz ±: ±10%; ComponentLink1URL: http://www.farnell.com/datasheets/1870456.pdf; ComponentLink1Description: http://www.farnell.com/datasheets/1870456.pdf
D11-D20 = LED0: as D1 on sheet uc1B; Published: 8-Jun-2000; LatestRevisionDate: 08-Jul-2005; LatestRevisionNote: Mech Layer 1 removed.; PackageReference: LED-0; Publisher: Altium Limited; PackageDescription: LED; 2 Leads; Supplier 1: Farnell; Supplier Part Number 1: 1659076; RoHS: YES; Stock 1: 12975; Pricing 1: 5=0,105, 25=0,0998, 100=0,0952, 250=0,0917, 500=0,0865, 2000=0,0771, 4000=0,0717, 20000=0,0689 (EUR); MSL: MSL 2A - 4 Wochen; Anzahl der Pins: 2; Dominante Wellenlänge: 575; Durchlassspannung Vf max.: 2.4; Durchlassstrom If, max.: 2; Lichtstärke, typ.: 1.6; ComponentLink1URL: http://www.farnell.com/datasheets/1698102.pdf; ComponentLink1Description: http://www.farnell.com/datasheets/1698102.pdf
R18-R25 = Res2: Resistor; Manufacturer: MULTICOMP; Manufacturer Part Number: MCSR08X4700FTL; Produktpalette: Baureihe MCSR 08; Widerstand: 470; Nennleistung: 125; Widerstandstoleranz: ±1%; Bauform: 0805 [Metrisch 2012]; Widerstandselement: Keramik; Temperaturkoeffizient: ±100; Nennspannung: 150; Verpackung: Gurtabschnitt; SVHC: No SVHC (17-Dec-2014); Widerstandsmontage: Oberflächenmontage<!--FANDB--><div class="features-and-benefits-container"></div>; Published: 8-Jun-2000; LatestRevisionDate: 17-Jul-2002; LatestRevisionNote: Re-released for DXP Platform.; PackageReference: AXIAL-0.4; Publisher: Altium Limited; PackageDescription: Axial Device, Thru-Hole; 2 Leads; 0.4 in Pin Spacing; Value: 470R; Supplier 1: Farnell; Supplier Part Number 1: 2074468; RoHS: YES; Stock 1: 1200; Pricing 1: 100=0,011, 500=0,01, 1000=0,009 (EUR); MSL: -; ComponentLink1URL: http://www.farnell.com/datasheets/1716717.pdf; ComponentLink1Description: http://www.farnell.com/datasheets/1716717.pdf
R26-R33 = Res2: Resistor; Manufacturer: MULTICOMP; Manufacturer Part Number: MC01W0805110K; Produktpalette: Baureihe MC; Widerstand: 10; Nennleistung: 100; Widerstandstoleranz: ±1%; Bauform: 0805 [Metrisch 2012]; Widerstandselement: Dickschicht; Temperaturkoeffizient: ±100; Nennspannung: 150; Verpackung: Gurtabschnitt; SVHC: No SVHC (17-Dec-2014); Anzahl der Pins: 2; Außenbreite: 1.25; Außentiefe: 0.55; Bandbreite: 8; Baureihe: MC; Betriebstemperatur: -55°C bis +155; Betriebstemperatur, max.: 155; Betriebstemperatur, min.: -55; Menge pro Rolle: 5000; Toleranz (+): 1%; Widerstandsmontage: Oberflächenmontage<!--FANDB--><div class="features-and-benefits-container"></div>; Published: 8-Jun-2000; LatestRevisionDate: 17-Jul-2002; LatestRevisionNote: Re-released for DXP Platform.; PackageReference: AXIAL-0.4; Publisher: Altium Limited; PackageDescription: Axial Device, Thru-Hole; 2 Leads; 0.4 in Pin Spacing; Value: 10k; Supplier 1: Farnell; Supplier Part Number 1: 9332391; RoHS: Y-EX; Stock 1: 4370; Pricing 1: 50=0,038, 250=0,031, 1000=0,022, 5000=0,014, 15000=0,009 (EUR); MSL: -; Außenlänge/-höhe: 2; Nennspannung, V DC: 150; Temperaturkoeffizient, +: 100; Temperaturkoeffizient, -: 100; Toleranz (-): 1%; ComponentLink1URL: http://www.farnell.com/datasheets/1729047.pdf; ComponentLink1Description: http://www.farnell.com/datasheets/1729047.pdf; ComponentLink2URL: http://www.farnell.com/cad/1561156.zip; ComponentLink2Description: http://www.farnell.com/cad/1561156.zip
R34-R43 = Res2: as R47 on sheet connector; Published: 8-Jun-2000; LatestRevisionDate: 17-Jul-2002; LatestRevisionNote: Re-released for DXP Platform.; PackageReference: AXIAL-0.4; Publisher: Altium Limited; PackageDescription: Axial Device, Thru-Hole; 2 Leads; 0.4 in Pin Spacing; Value: 1k; Supplier 1: Farnell; Supplier Part Number 1: 9332391; RoHS: Y-EX; Stock 1: 4370; Pricing 1: 50=0,038, 250=0,031, 1000=0,022, 5000=0,014, 15000=0,009 (EUR); ComponentLink1URL: http://www.farnell.com/datasheets/1729047.pdf; ComponentLink1Description: http://www.farnell.com/datasheets/1729047.pdf; ComponentLink2URL: http://www.farnell.com/cad/1561156.zip; ComponentLink2Description: http://www.farnell.com/cad/1561156.zip
R44 = Res2: as R13 on sheet uc1B; Published: 8-Jun-2000; LatestRevisionDate: 17-Jul-2002; LatestRevisionNote: Re-released for DXP Platform.; PackageReference: AXIAL-0.4; Publisher: Altium Limited; PackageDescription: Axial Device, Thru-Hole; 2 Leads; 0.4 in Pin Spacing; Value: 4k7; Supplier 1: Farnell; Supplier Part Number 1: 9333266; RoHS: Y-EX; Stock 1: 190984; Pricing 1: 50=0,038, 250=0,031, 1000=0,022, 5000=0,014, 15000=0,009 (EUR); MSL: -; Außenlänge/-höhe: 2; Nennspannung, V DC: 150; Temperaturkoeffizient, +: 100; Temperaturkoeffizient, -: 100; Toleranz (-): 1%; ComponentLink1URL: http://www.farnell.com/datasheets/1729047.pdf; ComponentLink1Description: http://www.farnell.com/datasheets/1729047.pdf; ComponentLink2URL: http://www.farnell.com/cad/1561170.zip; ComponentLink2Description: http://www.farnell.com/cad/1561170.zip
U2 = CMP-0243-00063-2: as U1 on sheet uc1B; ComponentLink3Description: Package Specification; PackageVersion: Rev. 4, 06/2013; PartNumber: STM32F407ZGT6J; ComponentLink3URL: http://www.st.com/st-web-ui/static/active/en/resource/technical/document/datasheet/DM00037051.pdf; PackageReference: LQFP144; ComponentLink2URL: http://www.st.com/st-web-ui/static/active/en/resource/technical/document/datasheet/DM00037051.pdf; ComponentLink2Description: Datasheet; ComponentLink1Description: Manufacturer URL; Mounting Technology: Surface Mount; Core: ARM Cortex-M4; PackageDescription: 144-Pin Low Profile Quad Flat Package, 20 x 20 mm Body, 0.5 mm Pitch; Packing: Tray; ComponentLink1URL: http://www.st.com/web/en/home.html; DatasheetVersion: Rev. 4; PartId: 1; Supplier 1: Farnell; Supplier Part Number 1: 2333299
Y2 = Oszillator: Oscillator with Enable Input; Supplier 1: Farnell; Supplier Part Number 1: 1640997

## Sheet uc2C.SchDoc: Microcontroller 3 (Part A)
size A4; Author: Marcel Hellwig; Organization: Hamburg Bit-Bots; Address1: Vogt-Kölln-Str. 30; Address2: 22527 Hamburg; Address3: Germany; Address4: www.bit-bots.de; DocumentNumber: 9; Revision: A; SheetNumber: 9; SheetTotal: 16; EMail: info@bit-bots.de
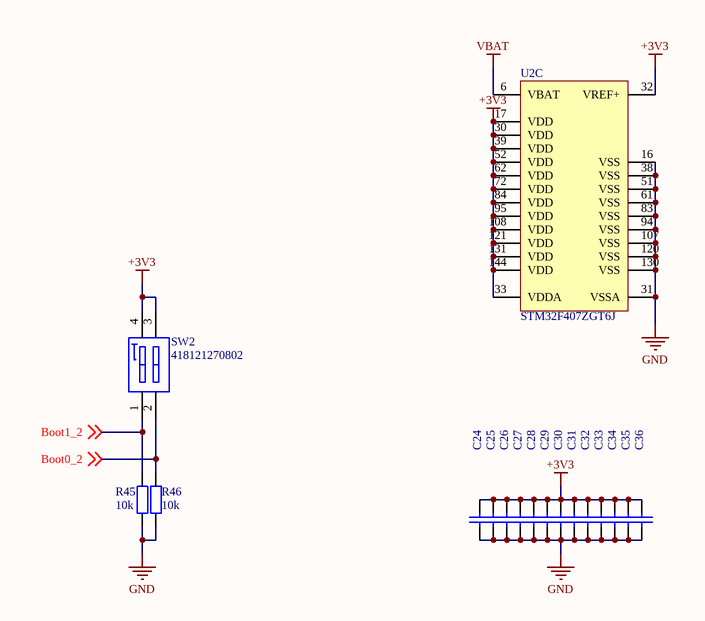
[diagram p14: uc2C.SchDoc]

### Parts
C24  100nF  [C2012]  (value not drawn)
C25  100nF  [C2012]  (value not drawn)
C26  100nF  [C2012]  (value not drawn)
C27  100nF  [C2012]  (value not drawn)
C28  100nF  [C2012]  (value not drawn)
C29  100nF  [C2012]  (value not drawn)
C30  100nF  [C2012]  (value not drawn)
C31  100nF  [C2012]  (value not drawn)
C32  100nF  [C2012]  (value not drawn)
C33  100nF  [C2012]  (value not drawn)
C34  100nF  [C2012]  (value not drawn)
C35  100nF  [C2012]  (value not drawn)
C36  100nF  [C2012]  (value not drawn)
R45  10k  [R2012]
R46  10k  [R2012]
SW2  418121270802  [418121270802]
U2  STM32F407ZGT6J  [STM-LQFP144_M]  (part C of 3)

### Nets
+3V3: C24.2 C25.2 C26.2 C27.2 C28.2 C29.2 C30.2 C31.2 C32.2 C33.2 C34.2 C35.2 C36.2 SW2.3 SW2.4 U2.17(VDD) U2.30(VDD) U2.32(VREF+) U2.33(VDDA) U2.39(VDD) U2.52(VDD) U2.62(VDD) U2.72(VDD) U2.84(VDD) U2.95(VDD) U2.108(VDD) U2.121(VDD) U2.131(VDD) U2.144(VDD)
GND: C24.1 C25.1 C26.1 C27.1 C28.1 C29.1 C30.1 C31.1 C32.1 C33.1 C34.1 C35.1 C36.1 R45.2 R46.1 U2.16(VSS) U2.31(VSSA) U2.38(VSS) U2.51(VSS) U2.61(VSS) U2.83(VSS) U2.94(VSS) U2.107(VSS) U2.120(VSS) U2.130(VSS)
VBAT: U2.6(VBAT)
Boot0_2: R46.2 SW2.2 ; off-sheet Boot0_2
Boot1_2: R45.1 SW2.1 ; off-sheet Boot1_2

### Notes on the sheet
- Project:
- Author:
- Title:
- Rev:
- Date:
- Time:
- Sheet
- of

### Library data of the parts
C24-C36 = Cap: as C3 on sheet uc1B; Published: 8-Jun-2000; LatestRevisionDate: 17-Jul-2002; LatestRevisionNote: Re-released for DXP Platform.; PackageReference: RAD-0.3; Publisher: Altium Limited; PackageDescription: Radial Cap, Thru-Hole; 2 Leads; 0.3 in Pin Spacing; Value: 100nF; Supplier 1: Farnell; Supplier Part Number 1: 1759265; RoHS: YES; Stock 1: 692587; Pricing 1: 10=0,013, 100=0,011, 500=0,009, 1000=0,008, 2000=0,006 (EUR); MSL: -; Bauform: 0805 [Metrisch 2012]; Kapazitätstoleranz ±: ±10%; ComponentLink1URL: http://www.farnell.com/datasheets/1870456.pdf; ComponentLink1Description: http://www.farnell.com/datasheets/1870456.pdf
R45 R46 = Res2: as R47 on sheet connector; Published: 8-Jun-2000; LatestRevisionDate: 17-Jul-2002; LatestRevisionNote: Re-released for DXP Platform.; PackageReference: AXIAL-0.4; Publisher: Altium Limited; PackageDescription: Axial Device, Thru-Hole; 2 Leads; 0.4 in Pin Spacing; Value: 10k; Supplier 1: Farnell; Supplier Part Number 1: 9332391; RoHS: Y-EX; Stock 1: 4370; Pricing 1: 50=0,038, 250=0,031, 1000=0,022, 5000=0,014, 15000=0,009 (EUR); ComponentLink1URL: http://www.farnell.com/datasheets/1729047.pdf; ComponentLink1Description: http://www.farnell.com/datasheets/1729047.pdf; ComponentLink2URL: http://www.farnell.com/cad/1561156.zip; ComponentLink2Description: http://www.farnell.com/cad/1561156.zip
SW2 = CMP-1438-00002-1: as SW1 on sheet uc1C; ComponentLink2URL: http://katalog.we-online.de/em/datasheet/4181212708xx.pdf; ComponentLink2Description: Datasheet; PackageReference: 418121270802; ComponentLink1Description: Manufacturer URL; PartNumber: 418121270802; ComponentLink1URL: http://www.we-online.com; Supplier 1: Farnell; Supplier Part Number 1: 1960894; RoHS: YES; Pricing 1: 1=1,79, 10=1,49, 25=1,23, 50=1,01, 100=0,921, 200=0,821, 500=0,651, 2000=0,625 (EUR); ComponentLink3URL: http://www.farnell.com/datasheets/1763372.pdf; ComponentLink3Description: http://www.farnell.com/datasheets/1763372.pdf
U2 = CMP-0243-00063-2: as U1 on sheet uc1B; ComponentLink3Description: Package Specification; PackageVersion: Rev. 4, 06/2013; PartNumber: STM32F407ZGT6J; ComponentLink3URL: http://www.st.com/st-web-ui/static/active/en/resource/technical/document/datasheet/DM00037051.pdf; PackageReference: LQFP144; ComponentLink2URL: http://www.st.com/st-web-ui/static/active/en/resource/technical/document/datasheet/DM00037051.pdf; ComponentLink2Description: Datasheet; ComponentLink1Description: Manufacturer URL; Mounting Technology: Surface Mount; Core: ARM Cortex-M4; PackageDescription: 144-Pin Low Profile Quad Flat Package, 20 x 20 mm Body, 0.5 mm Pitch; Packing: Tray; ComponentLink1URL: http://www.st.com/web/en/home.html; DatasheetVersion: Rev. 4; PartId: 1; Supplier 1: Farnell; Supplier Part Number 1: 2333299

## Sheet flash.SchDoc: Flash Section
size A4; Author: Marcel Hellwig; Organization: Hamburg Bit-Bots; Address1: Vogt-Kölln-Str. 30; Address2: 22527 Hamburg; Address3: Germany; Address4: www.bit-bots.de; DocumentNumber: 16; SheetNumber: 16; SheetTotal: 16; EMail: info@bit-bots.de
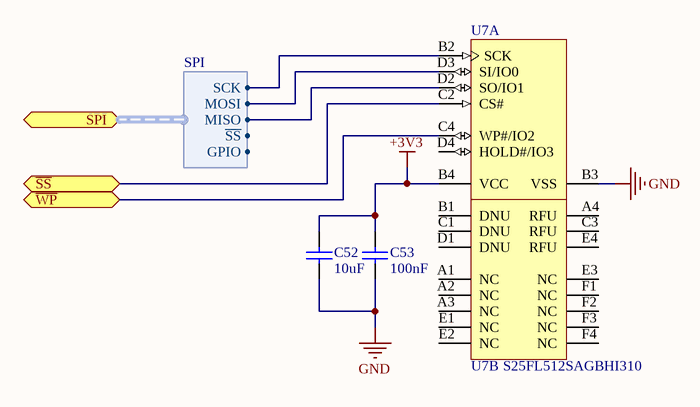
[diagram p15: flash.SchDoc]

### Parts
C52  10uF  [C2012]
C53  100nF  [C2012]
U7  S25FL512SAGBHI310  [SPSN-FAC024]  (value not drawn)  (parts A,B of 2)

### Ports
SPI (harness SPI), ~{SS} (bidir), ~{WP} (bidir)

### Harnesses
SPI: ~{SS}, GPIO, MISO, MOSI, SCK

### Nets
+3V3: C52.1 C53.1 U7.B4(VCC)
GND: C52.2 C53.2 U7.B3(VSS)
~{FLASH_SS}: U7.C2(CS#) ; port ~{SS}
~{FLASH_WP}: U7.C4(WP#/IO2) ; port ~{WP}
SPI2.SCK: U7.B2(SCK) ; port SPI.SCK
NetP1_B38: U7.D3(SI/IO0) ; port SPI.MOSI
NetP1_B39: U7.D2(SO/IO1) ; port SPI.MISO

Not connected (* = marked no-connect by the designer): U7 A1(NC) A2(NC) A3(NC) A4(RFU) B1(DNU) C1(DNU) C3(RFU) D1(DNU) D4(HOLD#/IO3) E1(NC) E2(NC) E3(NC) E4(RFU) F1(NC) F2(NC) F3(NC) F4(NC)

### Notes on the sheet
- Project:
- Author:
- Title:
- Rev:
- Date:
- Time:
- Sheet
- of

### Library data of the parts
C52 = Cap: Capacitor; Manufacturer: MULTICOMP; Manufacturer Part Number: MC0805X106K250CT; Produktpalette: Baureihe MC; Kapazität: 10; Kapazitätstoleranz: ±10%; Dielektrikum: X5; Nennspannung: 25; Keramikkondensatorgehäuse: 0805 [Metrisch 2012]; Betriebstemperatur, min.: -55; Betriebstemperatur, max.: 85; Verpackung: Gurtabschnitt; Kondensatoranschlüsse: SMD<!--FANDB--><div class="features-and-benefits-container"></div>; Published: 8-Jun-2000; LatestRevisionDate: 17-Jul-2002; LatestRevisionNote: Re-released for DXP Platform.; PackageReference: RAD-0.3; Publisher: Altium Limited; PackageDescription: Radial Cap, Thru-Hole; 2 Leads; 0.3 in Pin Spacing; Value: 10uF; Supplier 1: Farnell; Supplier Part Number 1: 2320833; RoHS: YES; Stock 1: 46180; Pricing 1: 10=0,147, 100=0,121, 500=0,1, 1000=0,083, 1500=0,066 (EUR); MSL: MSL 1 - unbegrenzt; Bauform: 0805 [Metrisch 2012]; Kapazitätstoleranz ±: ±10%; ComponentLink1URL: http://www.farnell.com/datasheets/1870456.pdf; ComponentLink1Description: http://www.farnell.com/datasheets/1870456.pdf
C53 = Cap: as C3 on sheet uc1B; Published: 8-Jun-2000; LatestRevisionDate: 17-Jul-2002; LatestRevisionNote: Re-released for DXP Platform.; PackageReference: RAD-0.3; Publisher: Altium Limited; PackageDescription: Radial Cap, Thru-Hole; 2 Leads; 0.3 in Pin Spacing; Value: 100nF; Supplier 1: Farnell; Supplier Part Number 1: 1759265; RoHS: YES; Stock 1: 692437; Pricing 1: 10=0,013, 100=0,011, 500=0,009, 1000=0,008, 2000=0,006 (EUR); MSL: -; Bauform: 0805 [Metrisch 2012]; Kapazitätstoleranz ±: ±10%; ComponentLink1URL: http://www.farnell.com/datasheets/1870456.pdf; ComponentLink1Description: http://www.farnell.com/datasheets/1870456.pdf
U7 = CMP-1329-00014-1: MirrorBit Flash Non-Volatile Memory CMOS 3.0 Volt Core with Versatile I/O, Serial Peripheral Interface with Multi-I/O, 128 Mbit, 133 MHz, -40 to 85 degC, 24-Ball BGA (FAC024), RoHS, Tray; PartNumber: S25FL128SAGBHI310; Manufacturer: Spansion; Speed: 133 MHz; OTP: 1024 B; VCC: 2.7 to 3.6 V; Packing: Tray; ComponentLink2Description: Datasheet; ComponentLink1Description: Manufacturer URL; ComponentLink3URL: http://www.spansion.com/Support/Datasheets/S25FL128S_256S_00.pdf; PackageDescription: 24-Ball Ball Grid Array, Body 6 x 8 mm, Pitch 1 mm; Temperature Range: -40 to 85 degC; Density: 128 Mbit; Mounting Technology: Surface Mount; RoHS: TRUE; ComponentLink1URL: http://www.spansion.com/Pages/Default.aspx; ComponentLink3Description: Package Specification; DatasheetVersion: Rev. 08; ComponentLink2URL: http://www.spansion.com/Support/Datasheets/S25FL128S_256S_00.pdf; PartId: 1; Supplier 1: Farnell; Supplier Part Number 1: 2340547

## Nets that join several sheets
+1V8: connector (P1.B44), voltage_translation (C50.1 R56.2 R57.2 TR2.2)
+3V3: RS485_3 (C411.1 TR11.14), connector (14 pins), touchscreen (C44.1 C45.1 R51.2 U6.1), RS485_1 (C412.1 TR12.14), RS485_2 (C413.1 TR13.14), srl (C42.1 U4.14), voltage_translation (R53.1 R54.1 R55.2), uc1A (P2.2 R1.1 R2.2), uc1B (14 pins), uc1C (29 pins), uc2A (P3.2 R16.1 R17.2), uc2B (14 pins), uc2C (29 pins), flash (C52.1 C53.1 U7.B4)
+5V: connector (C38.1 P1.A3 P1.B3), ttl (C43.1 U5.14)
GND: RS485_3 (C411.2 TR11.7), connector (21 pins), ttl (8 pins), touchscreen (11 pins), RS485_1 (C412.2 TR12.7), RS485_2 (C413.2 TR13.7), srl (5 pins), voltage_translation (C50.2 C51.2 TR2.1), uc1A (P2.10), uc1B (7 pins), uc1C (26 pins), uc2A (P3.10), uc2B (14 pins), uc2C (25 pins), flash (C52.2 C53.2 U7.B3)
VBAT: uc1C (BT1.1 U1.6), uc2C (U2.6)
~{FLASH_SS}: uc2A (U2.27), flash (U7.C2)
~{FLASH_WP}: uc2A (U2.26), flash (U7.C4)
~{RST}: connector (P1.A11), uc1B (C3.2 R13.2 S1.1 U1.25), uc2B (C22.2 R44.2 U2.25)
A_N: RS485_3 (R481.1 TR11.11), connector (P1.A47)
A_N: connector (P1.A39), RS485_1 (R482.1 TR12.11)
A_N: connector (P1.A43), RS485_2 (R483.1 TR13.11)
A_P: RS485_3 (R481.2 TR11.12), connector (P1.A46)
A_P: connector (P1.A38), RS485_1 (R482.2 TR12.12)
A_P: connector (P1.A42), RS485_2 (R483.2 TR13.12)
Boot0_1: uc1B (U1.138), uc1C (R15.2 SW1.2)
Boot0_2: uc2B (U2.138), uc2C (R46.2 SW2.2)
Boot1_1: uc1A (U1.48), uc1C (R14.1 SW1.1)
Boot1_2: uc2A (U2.48), uc2C (R45.1 SW2.1)
BRIDGE2.DE: RS485_1 (TR12.4), uc1A (U1.37)
BRIDGE2.H/~{F}: RS485_1 (TR12.1), uc1A (U1.29)
BUT0: connector (P1.B12), uc2B (R26.1 U2.10)
BUT1: connector (P1.B13), uc2B (R27.1 U2.12)
BUT2: connector (P1.B14), uc2B (R28.1 U2.14)
BUT3: connector (P1.B15), uc2B (R29.1 U2.18)
BUT4: connector (P1.B16), uc2B (R30.1 U2.20)
BUT5: connector (P1.B17), uc2B (R31.1 U2.22)
BUT6: connector (P1.B18), uc2B (R32.1 U2.50)
BUT7: connector (P1.B19), uc2B (R33.1 U2.54)
GPIO0: connector (P1.B20), uc2B (U2.141)
GPIO1: connector (P1.B21), uc2B (U2.142)
GPIO2: connector (P1.B22), uc2B (U2.1)
GPIO3: connector (P1.B23), uc2B (U2.2)
GPIO4: connector (P1.B24), uc2B (U2.3)
GPIO5: connector (P1.B25), uc2B (U2.4)
GPIO6: connector (P1.B26), uc2B (U2.5)
GPIO7: connector (P1.B27), uc2B (U2.58)
GPIO8: connector (P1.B28), uc2B (U2.59)
GPIO9: connector (P1.B29), uc2B (U2.60)
GPIO10: connector (P1.B30), uc2B (U2.63)
GPIO11: connector (P1.B31), uc2B (U2.64)
GPIO12: connector (P1.B32), uc2B (U2.65)
GPIO13: connector (P1.B33), uc2B (U2.66)
GPIO14: connector (P1.B34), uc2B (U2.67)
GPIO15: connector (P1.B35), uc2B (U2.68)
LED_RING: connector (P1.A37), uc2A (U2.100)
LEDS0: connector (P1.A12), uc2B (R18.2)
LEDS1: connector (P1.A13), uc2B (R19.2)
LEDS2: connector (P1.A14), uc2B (R20.2)
LEDS3: connector (P1.A15), uc2B (R21.2)
LEDS4: connector (P1.A16), uc2B (R22.2)
LEDS5: connector (P1.A17), uc2B (R23.2)
LEDS6: connector (P1.A18), uc2B (R24.2)
LEDS7: connector (P1.A19), uc2B (R25.2)
NetC47_2: connector (P1.A30), touchscreen (C47.2 U6.17)
NetC48_2: connector (P1.A31), touchscreen (C48.2 U6.16)
NetC49_2: connector (P1.A34), touchscreen (C49.2 U6.3)
NetCN1_2: connector (CN1.2), uc2A (U2.75)
NetCN1_3: connector (CN1.3), uc2A (U2.76)
NetCN2_1: connector (CN2.1 R61.2), uc2A (U2.111)
NetCN2_2: connector (CN2.2 R62.2), uc2A (U2.112)
NetCN2_5: connector (CN2.5), uc2A (U2.113)
NetCN2_7: connector (CN2.7 R59.2), uc2A (U2.98)
NetCN2_8: connector (CN2.8 R60.2), uc2A (U2.99)
NetCN2_A: connector (CN2.A R47.1), uc2A (U2.97)
NetP1_A22: connector (P1.A22), uc2A (U2.35)
NetP1_A23: connector (P1.A23), uc2A (U2.34)
NetP1_A25: connector (P1.A25), touchscreen (U6.11), uc2A (R16.2 U2.136)
NetP1_A26: connector (P1.A26), touchscreen (U6.13), uc2A (R17.1 U2.137)
NetP1_A29: connector (P1.A29), touchscreen (U6.18)
NetP1_A32: connector (P1.A32), touchscreen (U6.15)
NetP1_A33: connector (P1.A33), touchscreen (U6.14)
NetP1_A35: connector (P1.A35), touchscreen (U6.7)
NetP1_B38: connector (P1.B38), uc2A (U2.29), flash (U7.D3)
NetP1_B39: connector (P1.B39), uc2A (U2.28), flash (U7.D2)
NetP1_B45: connector (P1.B45), voltage_translation (R56.1 TR2.3)
NetP1_B46: connector (P1.B46), voltage_translation (R57.1 TR2.4)
NetP1_B48: connector (P1.B48), uc1A (R1.2 U1.136)
NetP1_B49: connector (P1.B49), uc1A (R2.1 U1.137)
NetR53_2: voltage_translation (R53.2 TR2.5), uc1A (U1.102)
NetR54_2: voltage_translation (R54.2 TR2.6), uc1A (U1.101)
NetTR11_1: RS485_3 (TR11.1), uc1A (U1.116)
NetTR11_2: RS485_3 (TR11.2), uc1A (U1.122)
NetTR11_3: RS485_3 (TR11.3), uc1A (U1.117)
NetTR11_4: RS485_3 (TR11.4), uc1A (U1.118)
NetTR11_5: RS485_3 (TR11.5), uc1A (U1.119)
NetTR12_2: RS485_1 (TR12.2), uc1A (U1.35)
NetTR12_3: RS485_1 (TR12.3), uc1A (U1.36)
NetTR12_5: RS485_1 (TR12.5), uc1A (U1.34)
NetTR13_1: RS485_2 (TR13.1), uc1A (U1.79)
NetTR13_2: RS485_2 (TR13.2), uc1A (U1.78)
NetTR13_3: RS485_2 (TR13.3), uc1A (U1.80)
NetTR13_4: RS485_2 (TR13.4), uc1A (U1.81)
NetTR13_5: RS485_2 (TR13.5), uc1A (U1.77)
NetU1_40: uc1A (U1.40), uc2A (U2.40)
NetU1_41: uc1A (U1.41), uc2A (U2.41)
NetU1_42: uc1A (U1.42), uc2A (U2.42)
NetU1_43: uc1A (U1.43), uc2A (U2.43)
NetU1_63: srl (U4.5), uc1B (U1.63)
NetU1_64: srl (U4.4), uc1B (U1.64)
NetU1_65: srl (U4.12), uc1B (U1.65)
NetU1_66: srl (U4.13), uc1B (U1.66)
NetU1_67: srl (U4.2), uc1B (U1.67)
NetU1_68: srl (U4.1), uc1B (U1.68)
NetU1_96: ttl (U5.6), uc1A (U1.96)
NetU1_97: ttl (U5.2), uc1A (U1.97)
SD-CARD.CMD: connector (CN2.3 R58.2), uc2A (U2.116)
SDO: touchscreen (U6.9), uc2A (U2.36)
SPI1_1.GPIO: uc1A (U1.44), uc2A (U2.44)
SPI2~{.}SS: connector (P1.B40), uc2A (U2.73)
SPI2.GPIO: connector (P1.B37), uc2A (U2.70)
SPI2.SCK: connector (P1.B41), uc2A (U2.74), flash (U7.B2)
SRL1: RS485_1 (TR12.6), srl (U4.6)
SRL2: RS485_2 (TR13.6), srl (U4.11)
SRL3: RS485_3 (TR11.6), srl (U4.3)
Touchscreen.X-: connector (P1.A28), touchscreen (C46.2 R52.1 U6.19)
TTL_BRIDGE.EN_RX: ttl (U5.4), uc1B (U1.93)
TTL_BRIDGE.EN_TX: ttl (U5.1), uc1B (U1.92)
TTL_DATA: connector (P1.A36), ttl (U5.3 U5.5)
Y_N: RS485_3 (R491.2 TR11.10), connector (P1.A48)
Y_N: connector (P1.A40), RS485_1 (R492.2 TR12.10)
Y_N: connector (P1.A44), RS485_2 (R493.2 TR13.10)
Y_P: RS485_3 (R491.1 TR11.9), connector (P1.A49)
Y_P: connector (P1.A41), RS485_1 (R492.1 TR12.9)
Y_P: connector (P1.A45), RS485_2 (R493.1 TR13.9)